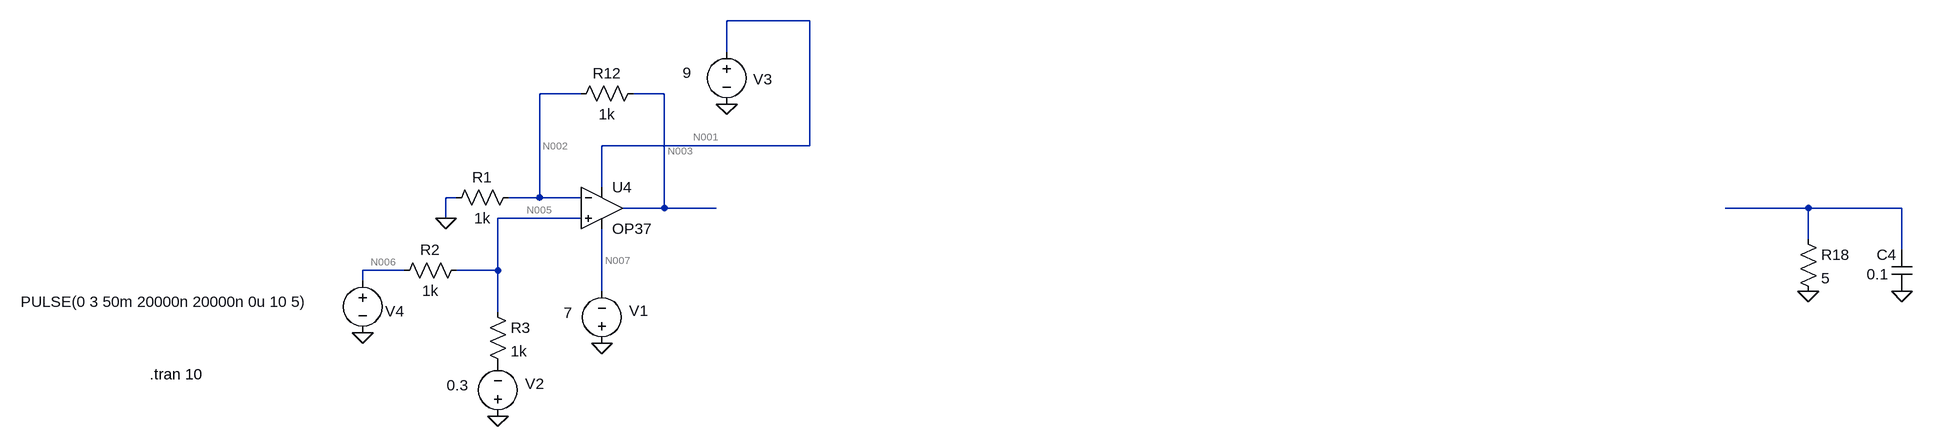
[diagram p0: schematic Lever_shifter.asc]
Lever_shifter.asc, the LTspice schematic file:
Version 4
SHEET 1 968 1160
WIRE -1024 32 -1152 32
WIRE -1152 80 -1152 32
WIRE -1376 144 -1440 144
WIRE -1248 144 -1296 144
WIRE -1024 224 -1024 32
WIRE -1024 224 -1344 224
WIRE -1344 288 -1344 224
WIRE -1568 304 -1584 304
WIRE -1440 304 -1440 144
WIRE -1440 304 -1488 304
WIRE -1376 304 -1440 304
WIRE -1248 320 -1248 144
WIRE -1248 320 -1312 320
WIRE -1168 320 -1248 320
WIRE 512 320 384 320
WIRE 656 320 512 320
WIRE -1584 336 -1584 304
WIRE -1376 336 -1504 336
WIRE 512 368 512 320
WIRE 656 384 656 320
WIRE -1648 416 -1712 416
WIRE -1504 416 -1504 336
WIRE -1504 416 -1568 416
WIRE -1712 432 -1712 416
WIRE -1344 448 -1344 352
WIRE -1504 480 -1504 416
FLAG -1344 528 0
FLAG -1152 160 0
FLAG -1712 512 0
FLAG 512 448 0
FLAG 656 448 0
FLAG -1584 336 0
FLAG -1504 640 0
SYMBOL res -1392 160 R270
WINDOW 0 32 56 VTop 2
WINDOW 3 0 56 VBottom 2
SYMATTR InstName R12
SYMATTR Value 1k
SYMBOL voltage -1344 544 R180
WINDOW 123 0 0 Left 2
WINDOW 39 0 0 Left 2
WINDOW 0 -71 66 Left 2
WINDOW 3 45 63 Left 2
SYMATTR InstName V1
SYMATTR Value 7
SYMBOL voltage -1152 64 R0
WINDOW 123 0 0 Left 2
WINDOW 39 0 0 Left 2
WINDOW 0 41 58 Left 2
WINDOW 3 -68 48 Left 2
SYMATTR InstName V3
SYMATTR Value 9
SYMBOL voltage -1712 416 R0
WINDOW 123 0 0 Left 2
WINDOW 39 0 0 Left 2
WINDOW 0 35 63 Left 2
WINDOW 3 -526 48 Left 2
SYMATTR InstName V4
SYMATTR Value PULSE(0 3 50m 20000n 20000n 0u 10 5)
SYMBOL res 496 352 R0
SYMATTR InstName R18
SYMATTR Value 5
SYMBOL res -1584 320 R270
WINDOW 0 32 56 VTop 2
WINDOW 3 0 56 VBottom 2
SYMATTR InstName R1
SYMATTR Value 1k
SYMBOL OpAmps\\OP37 -1344 256 R0
SYMATTR InstName U4
SYMBOL cap 672 448 R180
WINDOW 0 24 56 Left 2
WINDOW 3 36 26 Left 2
SYMATTR InstName C4
SYMATTR Value 0.1
SYMBOL voltage -1504 656 R180
WINDOW 123 0 0 Left 2
WINDOW 39 0 0 Left 2
WINDOW 0 -71 66 Left 2
WINDOW 3 45 63 Left 2
SYMATTR InstName V2
SYMATTR Value 0.3
SYMBOL res -1664 432 R270
WINDOW 0 32 56 VTop 2
WINDOW 3 0 56 VBottom 2
SYMATTR InstName R2
SYMATTR Value 1k
SYMBOL res -1520 464 R0
SYMATTR InstName R3
SYMATTR Value 1k
TEXT -2040 576 Left 2 !.tran 10

The netlist it stands for:
* Lever_shifter.asc
R12 N002 N003 1k
V1 0 N007 7
V3 N001 0 9
V4 N006 0 PULSE(0 3 50m 20000n 20000n 0u 10 5)
R18 N004 0 5
R1 0 N002 1k
XU4 N005 N002 N001 N007 N003 LT1037  ; OP37, pins In+ In- V+ V- OUT
C4 0 N004 0.1
V2 0 P001 0.3
R2 N006 N005 1k
R3 N005 P001 1k
.tran 10
.lib LTC.lib
.backanno
.end

* Results of the author's LTspice run, read from the files saved beside the schematic
* Operating Point, zero values left out:
*   V(n002) = -150 mV
*   V(n003) = -300 mV
*   V(n007) = -7 V
*   V(n001) = 9 V
*   V(n005) = -150 mV
*   V(p001) = -300 mV
*   I(R12) = 150 µA
*   I(R1) = 150 µA
*   I(R2) = 150 µA
*   I(R3) = 150 µA
*   I(V1) = -2.697 mA
*   I(V3) = -2.547 mA
*   I(V4) = -150 µA
*   I(V2) = -150 µA
*   Ix(u4:1) = -191.8 pA
*   Ix(u4:2) = -191.5 pA
*   Ix(u4:3) = 2.547 mA
*   Ix(u4:4) = -2.697 mA
*   Ix(u4:5) = 150 µA
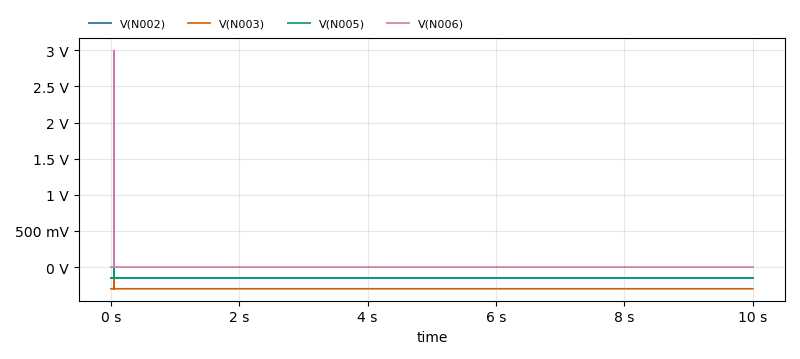
[diagram p1: Transient Analysis of Lever_shifter.asc, plotted from the saved traces]
* Transient Analysis, 1 run:
*   V(N002): min -150.3 mV, max 1.35 V, average -150 mV, rms 150 mV, last -150 mV
*   V(N003): min -300.4 mV, max 2.701 V, average -300 mV, rms 300 mV, last -300 mV
*   V(N005): min -150 mV, max 1.35 V, average -150 mV, rms 150 mV, last -150 mV
*   V(N006): min 0 V, max 3 V, average 6 µV, rms 3.602 mV, last 0 V